# EAGLE design STM32F446_ProtoBoard (EAGLE 9.7.0)
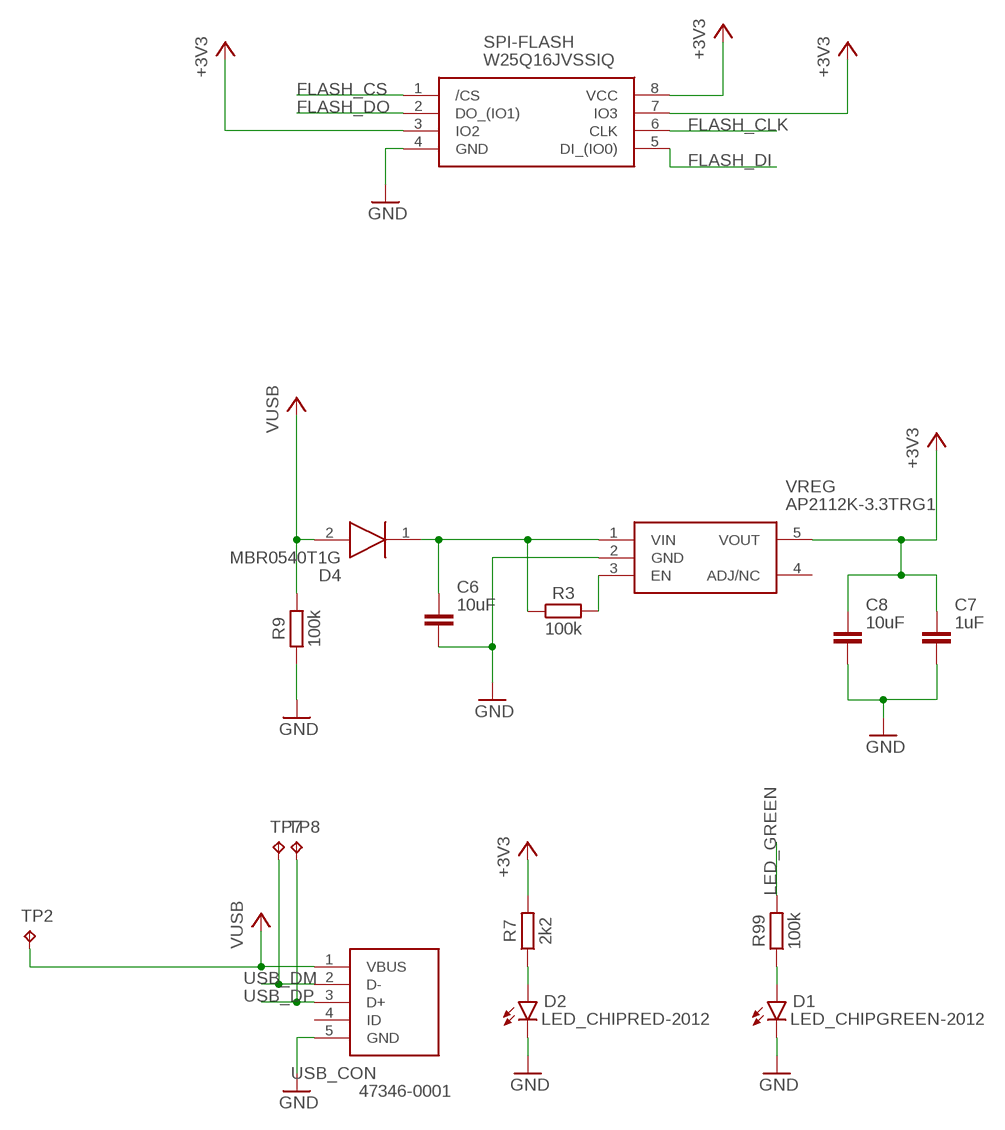
[diagram p0: schematic, sheet 1, part 1 of 2]
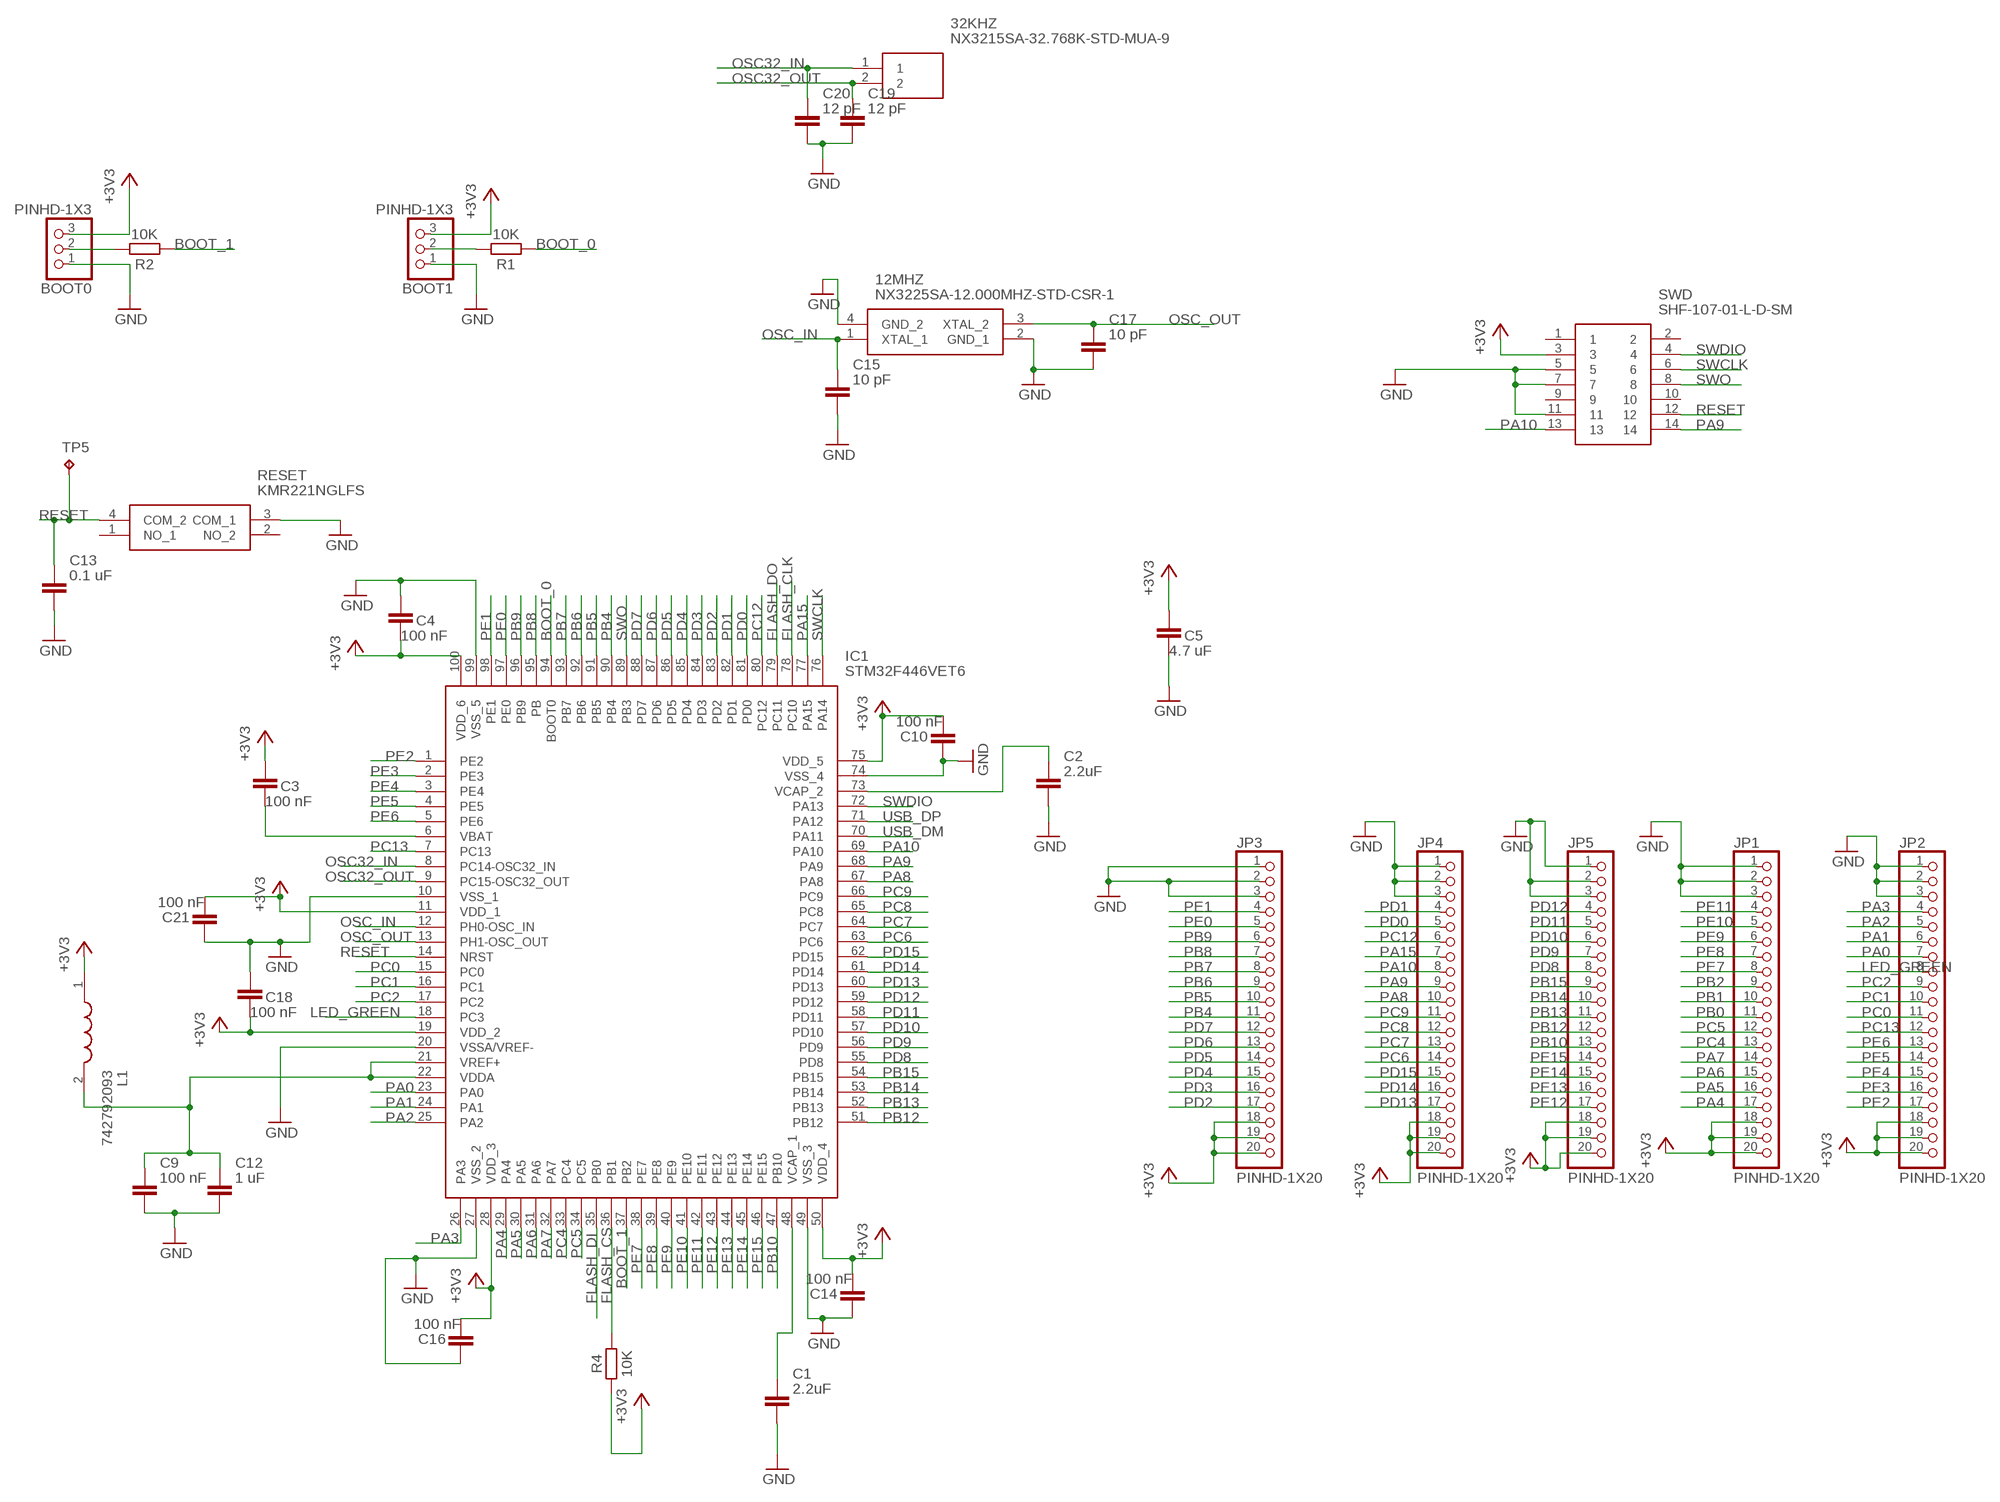
[diagram p1: schematic, sheet 1, part 2 of 2]

## Parts
12MHZ  NX3225SA-12.000MHZ-STD-CSR-1  [NX3225SA12000MHZSTDCSR1]
32KHZ  NX3215SA-32.768K-STD-MUA-9  [NX3215SA]
BOOT0  PINHD-1X3  [1X03]
BOOT1  PINHD-1X3  [1X03]
C1  2.2uF  C_CHIP-0805(2012-METRIC)  [CAPC2012X110]
C2  2.2uF  C_CHIP-0805(2012-METRIC)  [CAPC2012X110]
C3  100 nF  C_CHIP-0805(2012-METRIC)  [CAPC2012X110]
C4  100 nF  C_CHIP-0805(2012-METRIC)  [CAPC2012X110]
C5  4.7 uF  C_CHIP-0805(2012-METRIC)  [CAPC2012X110]
C6  10uF  C_CHIP-0805(2012-METRIC)  [CAPC2012X110]
C7  1uF  C_CHIP-0805(2012-METRIC)  [CAPC2012X110]
C8  10uF  C_CHIP-0805(2012-METRIC)  [CAPC2012X110]
C9  100 nF  C_CHIP-0805(2012-METRIC)  [CAPC2012X110]
C10  100 nF  C_CHIP-0805(2012-METRIC)  [CAPC2012X110]
C12  1 uF  C_CHIP-0805(2012-METRIC)  [CAPC2012X110]
C13  0.1 uF  C_CHIP-0805(2012-METRIC)  [CAPC2012X110]
C14  100 nF  C_CHIP-0805(2012-METRIC)  [CAPC2012X110]
C15  10 pF  C_CHIP-0805(2012-METRIC)  [CAPC2012X110]
C16  100 nF  C_CHIP-0805(2012-METRIC)  [CAPC2012X110]
C17  10 pF  C_CHIP-0805(2012-METRIC)  [CAPC2012X110]
C18  100 nF  C_CHIP-0805(2012-METRIC)  [CAPC2012X110]
C19  12 pF  C_CHIP-0805(2012-METRIC)  [CAPC2012X110]
C20  12 pF  C_CHIP-0805(2012-METRIC)  [CAPC2012X110]
C21  100 nF  C_CHIP-0805(2012-METRIC)  [CAPC2012X110]
D1  LED_CHIPGREEN-2012  [LEDC2012X110N_G]
D2  LED_CHIPRED-2012  [LEDC2012X110N_R]
D4  MBR0540T1G  [SOD3716X135N]
IC1  STM32F446VET6  [QFP50P1600X1600X160-100N]
JP1  PINHD-1X20  [1X20]
JP2  PINHD-1X20  [1X20]
JP3  PINHD-1X20  [1X20]
JP4  PINHD-1X20  [1X20]
JP5  PINHD-1X20  [1X20]
L1  742792093  [CAPC2012X110N]
R1  10K  R_CHIP-0805(2012-METRIC)  [RESC2012X65]
R2  10K  R_CHIP-0805(2012-METRIC)  [RESC2012X65]
R3  100k  R_CHIP-0805(2012-METRIC)  [RESC2012X65]
R4  10K  R_CHIP-0805(2012-METRIC)  [RESC2012X65]
R7  2k2  R_CHIP-0805(2012-METRIC)  [RESC2012X65]
R9  100k  R_CHIP-0805(2012-METRIC)  [RESC2012X65]
R99  100k  R_CHIP-0805(2012-METRIC)  [RESC2012X65]
RESET  KMR221NGLFS  [KMR221NGLFS]
SPI-FLASH  W25Q16JVSSIQ  [SOIC127P790X216-8N]
SWD  SHF-107-01-L-D-SM  [SHF-107-01-X-D-SM]
TP2  TPTP20R  [TP20R]
TP5  TPTP20R  [TP20R]
TP7  TPTP20R  [TP20R]
TP8  TPTP20R  [TP20R]
USB_CON  47346-0001  [47346-0001]
VREG  AP2112K-3.3TRG1  [SOT95P282X130-5N]

## Nets
+3V3: BOOT0.3 BOOT1.3 C3.1 C4.2 C5.1 C7.1 C8.1 C10.2 C14.2 C16.2 C18.2 C21.2 IC1.11(VDD_1) IC1.19(VDD_2) IC1.28(VDD_3) IC1.50(VDD_4) IC1.75(VDD_5) IC1.100(VDD_6) JP1.18 JP1.19 JP1.20 JP2.18 JP2.19 JP2.20 JP3.18 JP3.19 JP3.20 JP4.18 JP4.19 JP4.20 JP5.18 JP5.19 JP5.20 L1.1 R4.1 R7.2 SPI-FLASH.3(IO2) SPI-FLASH.7(IO3) SPI-FLASH.8(VCC) SWD.3 VREG.5(VOUT)
+5V: D4.2(A) R9.2 TP2.TP USB_CON.1(VBUS) ; supply symbol labelled VUSB
BOOT_0: IC1.94(BOOT0) R1.1
BOOT_1: IC1.37(PB2) R2.1
FLASH_CLK: IC1.78(PC10) SPI-FLASH.6(CLK)
FLASH_CS: IC1.36(PB1) R4.2 SPI-FLASH.1(/CS)
FLASH_DI: IC1.35(PB0) SPI-FLASH.5(DI_(IO0))
FLASH_DO: IC1.79(PC11) SPI-FLASH.2(DO_(IO1))
GND: 12MHZ.2(GND_1) 12MHZ.4(GND_2) BOOT0.1 BOOT1.1 C1.2 C2.2 C4.1 C5.2 C6.2 C7.2 C8.2 C9.2 C10.1 C12.2 C13.2 C14.1 C15.2 C16.1 C17.2 C18.1 C19.2 C20.2 C21.1 D1.1(C) D2.1(C) IC1.10(VSS_1) IC1.20(VSSA/VREF-) IC1.27(VSS_2) IC1.49(VSS_3) IC1.74(VSS_4) IC1.99(VSS_5) JP1.1 JP1.2 JP1.3 JP2.1 JP2.2 JP2.3 JP3.1 JP3.2 JP3.3 JP4.1 JP4.2 JP4.3 JP5.1 JP5.2 JP5.3 R9.1 RESET.3(COM_1) SPI-FLASH.4(GND) SWD.5 SWD.7 SWD.11 USB_CON.5(GND) VREG.2(GND)
LED_GREEN: IC1.18(PC3) JP2.8 R99.2
N$1: C6.1 D4.1(K) R3.1 VREG.1(VIN)
N$2: R3.2 VREG.3(EN)
N$3: D2.2(A) R7.1
N$4: D1.2(A) R99.1
N$5: C1.1 IC1.48(VCAP_1)
N$6: C3.2 IC1.6(VBAT)
N$7: BOOT1.2 R1.2
N$8: C2.1 IC1.73(VCAP_2)
N$9: BOOT0.2 R2.2
N$10: C9.1 C12.1 IC1.21(VREF+) IC1.22(VDDA) L1.2
OSC32_IN: 32KHZ.1 C20.1 IC1.8(PC14-OSC32_IN)
OSC32_OUT: 32KHZ.2 C19.1 IC1.9(PC15-OSC32_OUT)
OSC_IN: 12MHZ.1(XTAL_1) C15.1 IC1.12(PH0-OSC_IN)
OSC_OUT: 12MHZ.3(XTAL_2) C17.1 IC1.13(PH1-OSC_OUT)
PA0: IC1.23(PA0) JP2.7
PA1: IC1.24(PA1) JP2.6
PA2: IC1.25(PA2) JP2.5
PA3: IC1.26(PA3) JP2.4
PA4: IC1.29(PA4) JP1.17
PA5: IC1.30(PA5) JP1.16
PA6: IC1.31(PA6) JP1.15
PA7: IC1.32(PA7) JP1.14
PA8: IC1.67(PA8) JP4.10
PA9: IC1.68(PA9) JP4.9 SWD.14
PA10: IC1.69(PA10) JP4.8 SWD.13
PA15: IC1.77(PA15) JP4.7
PB0: JP1.11
PB1: JP1.10
PB2: JP1.9
PB4: IC1.90(PB4) JP3.11
PB5: IC1.91(PB5) JP3.10
PB6: IC1.92(PB6) JP3.9
PB7: IC1.93(PB7) JP3.8
PB8: IC1.95(PB) JP3.7
PB9: IC1.96(PB9) JP3.6
PB10: IC1.47(PB10) JP5.13
PB12: IC1.51(PB12) JP5.12
PB13: IC1.52(PB13) JP5.11
PB14: IC1.53(PB14) JP5.10
PB15: IC1.54(PB15) JP5.9
PC0: IC1.15(PC0) JP2.11
PC1: IC1.16(PC1) JP2.10
PC2: IC1.17(PC2) JP2.9
PC4: IC1.33(PC4) JP1.13
PC5: IC1.34(PC5) JP1.12
PC6: IC1.63(PC6) JP4.14
PC7: IC1.64(PC7) JP4.13
PC8: IC1.65(PC8) JP4.12
PC9: IC1.66(PC9) JP4.11
PC12: IC1.80(PC12) JP4.6
PC13: IC1.7(PC13) JP2.12
PD0: IC1.81(PD0) JP4.5
PD1: IC1.82(PD1) JP4.4
PD2: IC1.83(PD2) JP3.17
PD3: IC1.84(PD3) JP3.16
PD4: IC1.85(PD4) JP3.15
PD5: IC1.86(PD5) JP3.14
PD6: IC1.87(PD6) JP3.13
PD7: IC1.88(PD7) JP3.12
PD8: IC1.55(PD8) JP5.8
PD9: IC1.56(PD9) JP5.7
PD10: IC1.57(PD10) JP5.6
PD11: IC1.58(PD11) JP5.5
PD12: IC1.59(PD12) JP5.4
PD13: IC1.60(PD13) JP4.17
PD14: IC1.61(PD14) JP4.16
PD15: IC1.62(PD15) JP4.15
PE0: IC1.97(PE0) JP3.5
PE1: IC1.98(PE1) JP3.4
PE2: IC1.1(PE2) JP2.17
PE3: IC1.2(PE3) JP2.16
PE4: IC1.3(PE4) JP2.15
PE5: IC1.4(PE5) JP2.14
PE6: IC1.5(PE6) JP2.13
PE7: IC1.38(PE7) JP1.8
PE8: IC1.39(PE8) JP1.7
PE9: IC1.40(PE9) JP1.6
PE10: IC1.41(PE10) JP1.5
PE11: IC1.42(PE11) JP1.4
PE12: IC1.43(PE12) JP5.17
PE13: IC1.44(PE13) JP5.16
PE14: IC1.45(PE14) JP5.15
PE15: IC1.46(PE15) JP5.14
RESET: C13.1 IC1.14(NRST) RESET.4(COM_2) SWD.12 TP5.TP
SWCLK: IC1.76(PA14) SWD.6
SWDIO: IC1.72(PA13) SWD.4
SWO: IC1.89(PB3) SWD.8
USB_DM: IC1.70(PA11) TP7.TP USB_CON.2(D-)
USB_DP: IC1.71(PA12) TP8.TP USB_CON.3(D+)
Unconnected: RESET.1(NO_1) RESET.2(NO_2) SWD.1 SWD.2 SWD.9 SWD.10 USB_CON.4(ID) VREG.4(ADJ/NC)

## Library data of the parts
12MHZ = SamacSys_Parts:NX3225SA-12.000MHZ-STD-CSR-1: Crystals CRYSTAL 12MHZ 8PF SMD Source: Datasheet <https://media.digikey.com/pdf/Data Sheets/NDK PDFs/NX3225SA.pdf>; DESCRIPTION: Crystals CRYSTAL 12MHZ 8PF SMD; HEIGHT: 0.6mm; MANUFACTURER_NAME: NDK; MANUFACTURER_PART_NUMBER: NX3225SA-12.000MHZ-STD-CSR-1; MOUSER_PART_NUMBER: 344-NX3225SA12MCSR1; MOUSER_PRICE-STOCK: https://www.mouser.co.uk/ProductDetail/NDK/NX3225SA-12000MHZ-STD-CSR-1?qs=55YtniHzbhAnr2FgHSa1nw%3D%3D
32KHZ = SamacSys_Parts:NX3215SA-32.768K-STD-MUA-9: 32.768kHz +/-20ppm Crystal 9pF 70 kOhms 2-SMD, No Lead Source: Datasheet <http://www.ndk.com/images/products/catalog/c_NX3215SA-STD-MUA-14_e.pdf>; DESCRIPTION: 32.768kHz +/-20ppm Crystal 9pF 70 kOhms 2-SMD, No Lead; HEIGHT: mm; MANUFACTURER_NAME: NDK; MANUFACTURER_PART_NUMBER: NX3215SA-32.768K-STD-MUA-9; MOUSER_PART_NUMBER: 344-NX3215SA32768K9; MOUSER_PRICE-STOCK: https://www.mouser.co.uk/ProductDetail/NDK/NX3215SA-32768K-STD-MUA-9?qs=55YtniHzbhBxaiDkis6GSg%3D%3D
BOOT0 BOOT1 = Connector:PINHD-1X3: PIN HEADER; CATEGORY: CONNECTOR; SUB-CATEGORY: PIN-HEADER
C1-C10 C12-C21 = Capacitor:C: Capacitor - Generic; CATEGORY: Capacitor
D1 = Opto-Electronic:LED_CHIP: LED - Generic; CATEGORY: Opto-Electronic; COLOR: Green; SUB-CATEGORY: LED
D2 = Opto-Electronic:LED_CHIP: LED - Generic; CATEGORY: Opto-Electronic; COLOR: Red; SUB-CATEGORY: LED
D4 = SamacSys_Parts:MBR0540T1G: 0.5A 40V Schottky Rectifier, MBR0540T1G ON Semiconductor MBR0540T1G Schottky Diode, 0.5A, 40V, 2-Pin SOD-123 Source: Datasheet <http://www.onsemi.com/pub/Collateral/MBR0540T1-D.PDF>; DESCRIPTION: 0.5A 40V Schottky Rectifier, MBR0540T1G ON Semiconductor MBR0540T1G Schottky Diode, 0.5A, 40V, 2-Pin SOD-123; HEIGHT: 1.35mm; MANUFACTURER_NAME: ON Semiconductor; MANUFACTURER_PART_NUMBER: MBR0540T1G; MOUSER_PART_NUMBER: 863-MBR0540T1G; MOUSER_PRICE-STOCK: https://www.mouser.co.uk/ProductDetail/ON-Semiconductor/MBR0540T1G?qs=3JMERSakebqeY0cO5%252BUPCQ%3D%3D
IC1 = SamacSys_Parts:STM32F446VET6: STMICROELECTRONICS - STM32F446VET6 - MCU, 32BIT, CORTEX-M4, 180MHZ, LQFP-100 Source: Datasheet; DESCRIPTION: STMICROELECTRONICS - STM32F446VET6 - MCU, 32BIT, CORTEX-M4, 180MHZ, LQFP-100; HEIGHT: 1.6mm; MANUFACTURER_NAME: STMicroelectronics; MANUFACTURER_PART_NUMBER: STM32F446VET6; MOUSER_PART_NUMBER: 511-STM32F446VET6; MOUSER_PRICE-STOCK: https://www.mouser.co.uk/ProductDetail/STMicroelectronics/STM32F446VET6?qs=Ok1pvOkw6%2Fq9jAtbG%252BoMSQ%3D%3D
JP1-JP5 = Connector:PINHD-1X20: PIN HEADER; CATEGORY: CONNECTOR; SUB-CATEGORY: PIN-HEADER
L1 = SamacSys_Parts:742792093: Wurth WE-CBF Series +/-25% Ferrite Multilayer SMD Inductor, 0805 (2012M) Case, 200mA dc 600m Rdc Source: Datasheet; DESCRIPTION: Wurth WE-CBF Series +/-25% Ferrite Multilayer SMD Inductor, 0805 (2012M) Case, 200mA dc 600m Rdc; HEIGHT: 1.1mm; MANUFACTURER_NAME: Wurth Elektronik; MANUFACTURER_PART_NUMBER: 742792093; MOUSER_PART_NUMBER: 710-742792093; MOUSER_PRICE-STOCK: https://www.mouser.co.uk/ProductDetail/Wurth-Elektronik/742792093?qs=5twSNpOB8IAc9a1vXvOuYw%3D%3D
R1-R4 R7 R9 R99 = Resistor:R: Resistor Fixed - Generic; CATEGORY: Resistor; SUB-CATEGORY: Fixed
RESET = SamacSys_Parts:KMR221NGLFS: KMR221NGLFS (Tactile Switches) Source: Datasheet <https://www.ckswitches.com/media/1479/kmr2.pdf>; DESCRIPTION: KMR221NGLFS (Tactile Switches); HEIGHT: 1.9mm; MANUFACTURER_NAME: C & K COMPONENTS; MANUFACTURER_PART_NUMBER: KMR221NGLFS; MOUSER_PART_NUMBER: 611-KMR221NGLFS; MOUSER_PRICE-STOCK: https://www.mouser.co.uk/ProductDetail/CK/KMR221NGLFS?qs=sb%252But3Lm4x2H4qewmcuXNA%3D%3D
SPI-FLASH = SamacSys_Parts:W25Q16JVSSIQ: NOR Flash Serial-SPI 3V/3.3V 16M-bit 6ns 8-Pin SOIC Tube Source: Datasheet <https://www.winbond.com/resource-files/w25q16jv spi revd 08122016.pdf>; DESCRIPTION: NOR Flash Serial-SPI 3V/3.3V 16M-bit 6ns 8-Pin SOIC Tube; HEIGHT: 2.16mm; MANUFACTURER_NAME: Winbond; MANUFACTURER_PART_NUMBER: W25Q16JVSSIQ; MOUSER_PART_NUMBER: 454-W25Q16JVSSIQ; MOUSER_PRICE-STOCK: https://www.mouser.co.uk/ProductDetail/Winbond/W25Q16JVSSIQ?qs=qSfuJ%252Bfl%2Fd46L%2F1QrQC%2Fog%3D%3D
SWD = SamacSys_Parts:SHF-107-01-L-D-SM: 14 Position, Dual - Row, Shrouded Terminal Strip, 0.050" pitch Source: Datasheet <https://componentsearchengine.com/Datasheets/1/SHF-107-01-L-D-SM.pdf>; DESCRIPTION: 14 Position, Dual - Row, Shrouded Terminal Strip, 0.050&quot; pitch; HEIGHT: 5mm; MANUFACTURER_NAME: SAMTEC; MANUFACTURER_PART_NUMBER: SHF-107-01-L-D-SM; MOUSER_PART_NUMBER: 200-SHF10701LDSM; MOUSER_PRICE-STOCK: https://www.mouser.com/Search/Refine.aspx?Keyword=200-SHF10701LDSM
TP2 TP5 TP7 TP8 = testpad:TP: Test pad
USB_CON = SamacSys_Parts:47346-0001: Micro USB B Receptacle Bottom Mount Assy Molex Right Angle SMT Type B Version 2.0 Micro USB Connector Socket, 30 V ac, 1A 47352 MICRO-USB Source: Datasheet <http://www.molex.com/pdm_docs/sd/473460001_sd.pdf>; DESCRIPTION: Micro USB B Receptacle Bottom Mount Assy Molex Right Angle SMT Type B Version 2.0 Micro USB Connector Socket, 30 V ac, 1A 47352 MICRO-USB; HEIGHT: mm; MANUFACTURER_NAME: Molex; MANUFACTURER_PART_NUMBER: 47346-0001; MOUSER_PART_NUMBER: 538-47346-0001; MOUSER_PRICE-STOCK: https://www.mouser.co.uk/ProductDetail/Molex/47346-0001?qs=c2CV6XM0DweJBWaSeyWeCw%3D%3D
VREG = SamacSys_Parts:AP2112K-3.3TRG1: 600mA 3.3V LDO Regulator Enable SOT23-5 DiodesZetex AP2112K-3.3TRG1, LDO Voltage Regulator, 3.3 V +/-1.5%, 2.5 6 Vin, 5-Pin SOT-23 Source: Datasheet; DESCRIPTION: 600mA 3.3V LDO Regulator Enable SOT23-5 DiodesZetex AP2112K-3.3TRG1, LDO Voltage Regulator, 3.3 V +/-1.5%, 2.5 6 Vin, 5-Pin SOT-23; HEIGHT: 1.3mm; MANUFACTURER_NAME: Diodes Inc.; MANUFACTURER_PART_NUMBER: AP2112K-3.3TRG1; MOUSER_PART_NUMBER: 621-AP2112K-3.3TRG1; MOUSER_PRICE-STOCK: https://www.mouser.co.uk/ProductDetail/Diodes-Incorporated/AP2112K-33TRG1?qs=x6A8l6qLYDDPYHosCdzh%2FA%3D%3D

## Board
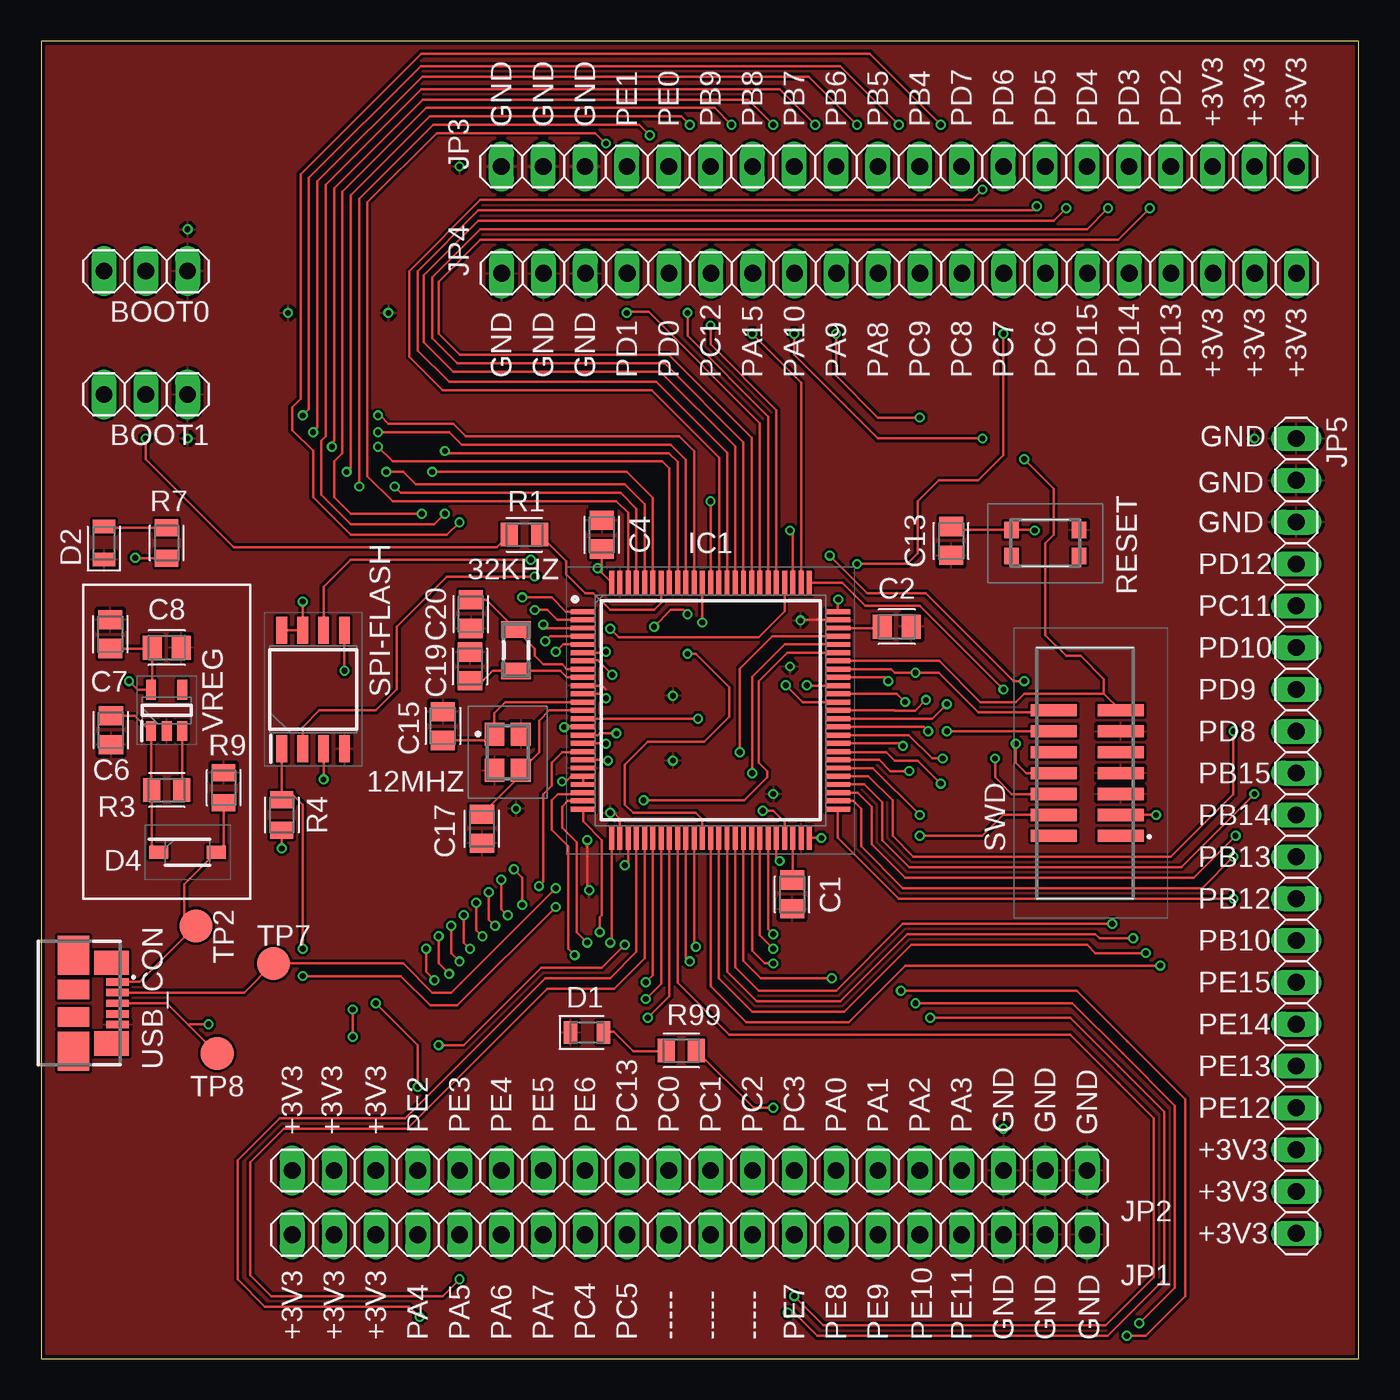
[diagram p2: board, top side]
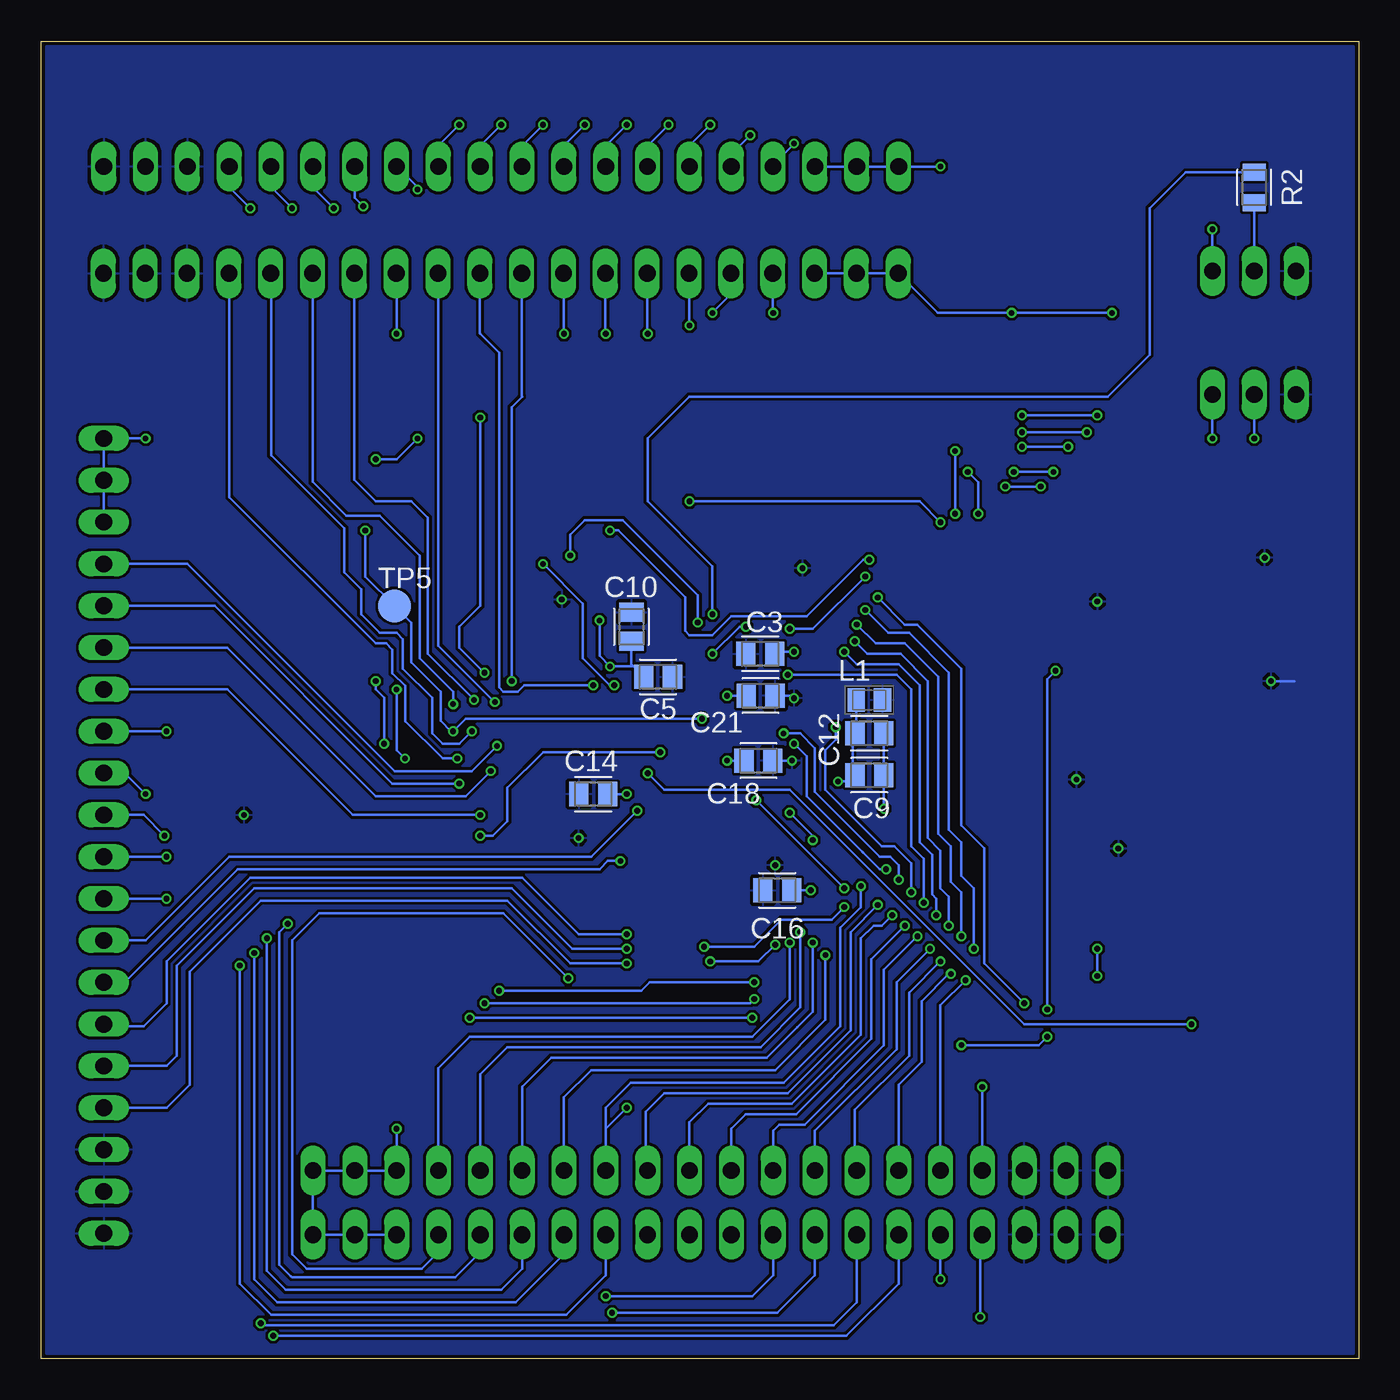
[diagram p3: board, bottom side, seen from below]

Size 80 x 80 mm. Coordinates in mm from the lower left corner, seen from the top.
Outline: 0,0 80,0 80,80 0,80 0,0
Copper layers (1*16): Top 0.018mm / dielectric 1.55mm / Bottom 0.018mm
Design rules "eC_2Layer_PClass6_BaseCopperO18_eCDefault": minimum track width 0.15mm, minimum drill 0.35mm, track to track 0.15mm, track to pad 0.15mm, pad to pad 0.15mm, via to via 0.15mm, smd to smd 0mil, copper to edge 0.25mm, drill to drill 0.35mm, minimum pad ring 0.175mm, minimum via ring 0.125mm, stop-mask expansion 0mil, vias tented up to drill 0.45mm, thermal gap 0.2mm

### Footprints (pad centres in the part's own frame; a part is rotated, then mirrored left to right if it is on the bottom)
NX3225SA12000MHZSTDCSR1 = smd 1.4 x 1.2: 1 -1.1,-0.8; 2 1.1,-0.8; 3 1.1,0.8; 4 -1.1,0.8
NX3215SA = smd 1 x 1.8: 1 -1.25,0; 2 1.25,0
1X03 = drill 1.016 long: 1 -2.54,0; 2 0,0; 3 2.54,0
CAPC2012X110 = smd 1.165 x 1.465: 1 -0.875,0; 2 0.875,0
LEDC2012X110N_G = smd 0.817 x 1.352: 1 -1,0 | smd 0.822 x 1.352: 2 0.998,0
LEDC2012X110N_R = smd 0.817 x 1.352: 1 -1,0 | smd 0.822 x 1.352: 2 0.998,0
SOD3716X135N = smd 1.15 x 0.8: 1 -1.75,0; 2 1.75,0
QFP50P1600X1600X160-100N = smd 1.475 x 0.3: 1 -7.738,6; 2 -7.738,5.5; 3 -7.738,5; 4 -7.738,4.5; 5 -7.738,4; 6 -7.738,3.5; 7 -7.738,3; 8 -7.738,2.5; 9 -7.738,2; 10 -7.738,1.5; 11 -7.738,1; 12 -7.738,0.5; 13 -7.738,0; 14 -7.738,-0.5; 15 -7.738,-1; 16 -7.738,-1.5; 17 -7.738,-2; 18 -7.738,-2.5; 19 -7.738,-3; 20 -7.738,-3.5; 21 -7.738,-4; 22 -7.738,-4.5; 23 -7.738,-5; 24 -7.738,-5.5; 25 -7.738,-6; 51 7.738,-6; 52 7.738,-5.5; 53 7.738,-5; 54 7.738,-4.5; 55 7.738,-4; 56 7.738,-3.5; 57 7.738,-3; 58 7.738,-2.5; 59 7.738,-2; 60 7.738,-1.5; 61 7.738,-1; 62 7.738,-0.5; 63 7.738,0; 64 7.738,0.5; 65 7.738,1; 66 7.738,1.5; 67 7.738,2; 68 7.738,2.5; 69 7.738,3; 70 7.738,3.5; 71 7.738,4; 72 7.738,4.5; 73 7.738,5; 74 7.738,5.5; 75 7.738,6 | smd 0.3 x 1.475: 26 -6,-7.738; 27 -5.5,-7.738; 28 -5,-7.738; 29 -4.5,-7.738; 30 -4,-7.738; 31 -3.5,-7.738; 32 -3,-7.738; 33 -2.5,-7.738; 34 -2,-7.738; 35 -1.5,-7.738; 36 -1,-7.738; 37 -0.5,-7.738; 38 0,-7.738; 39 0.5,-7.738; 40 1,-7.738; 41 1.5,-7.738; 42 2,-7.738; 43 2.5,-7.738; 44 3,-7.738; 45 3.5,-7.738; 46 4,-7.738; 47 4.5,-7.738; 48 5,-7.738; 49 5.5,-7.738; 50 6,-7.738; 76 6,7.738; 77 5.5,7.738; 78 5,7.738; 79 4.5,7.738; 80 4,7.738; 81 3.5,7.738; 82 3,7.738; 83 2.5,7.738; 84 2,7.738; 85 1.5,7.738; 86 1,7.738; 87 0.5,7.738; 88 0,7.738; 89 -0.5,7.738; 90 -1,7.738; 91 -1.5,7.738; 92 -2,7.738; 93 -2.5,7.738; 94 -3,7.738; 95 -3.5,7.738; 96 -4,7.738; 97 -4.5,7.738; 98 -5,7.738; 99 -5.5,7.738; 100 -6,7.738
1X20 = drill 1.016 long: 1 -24.13,0; 2 -21.59,0; 3 -19.05,0; 4 -16.51,0; 5 -13.97,0; 6 -11.43,0; 7 -8.89,0; 8 -6.35,0; 9 -3.81,0; 10 -1.27,0; 11 1.27,0; 12 3.81,0; 13 6.35,0; 14 8.89,0; 15 11.43,0; 16 13.97,0; 17 16.51,0; 18 19.05,0; 19 21.59,0; 20 24.13,0
CAPC2012X110N = smd 1.05 x 1.42: 1 -0.79,0; 2 0.79,0
RESC2012X65 = smd 1.031 x 1.42: 1 -0.919,0; 2 0.919,0
KMR221NGLFS = smd 0.9 x 1: 1 -2.05,-0.8; 2 2.05,-0.8; 3 2.05,0.8; 4 -2.05,0.8
SOIC127P790X216-8N = smd 1.65 x 0.65: 1 -3.6,1.905; 2 -3.6,0.635; 3 -3.6,-0.635; 4 -3.6,-1.905; 5 3.6,-1.905; 6 3.6,-0.635; 7 3.6,0.635; 8 3.6,1.905
SHF-107-01-X-D-SM = smd 0.74 x 2.795: 1 -3.81,-2.033; 2 -3.81,2.033; 3 -2.54,-2.033; 4 -2.54,2.033; 5 -1.27,-2.033; 6 -1.27,2.033; 7 0,-2.033; 8 0,2.033; 9 1.27,-2.033; 10 1.27,2.033; 11 2.54,-2.033; 12 2.54,2.033; 13 3.81,-2.033; 14 3.81,2.033
TP20R = smd 2 x 2: TP 0,0
47346-0001 = smd 0.45 x 1.38: 1 1.3,-4.81; 2 0.65,-4.81; 3 0,-4.81; 4 -0.65,-4.81; 5 -1.3,-4.81 | smd 1.475 x 2.1: 6 -2.453,-4.45; 7 2.453,-4.45 | smd 1.175 x 1.9: 8 0.838,-2.15; 9 -0.838,-2.15 | smd 2.375 x 1.9: 10 2.913,-2.15; 11 -2.913,-2.15
SOT95P282X130-5N = smd 1.2 x 0.6: 1 -1.25,0.95; 2 -1.25,0; 3 -1.25,-0.95; 4 1.25,-0.95; 5 1.25,0.95

### Placement (x,y rotation side)
12MHZ  28.32,36.83 270 top
32KHZ  28.83,43.02 270 top
BOOT0  6.35,66.04 180 top
BOOT1  6.35,58.55 180 top
C1  45.59,28.19 270 top
C2  51.94,44.45 0 top
C3  36.34,42.8 0 bottom
C4  34.04,50.04 270 top
C5  42.55,41.4 180 bottom
C6  4.24,38.16 270 top
C7  4.19,44 90 top
C8  7.62,43.18 0 top
C9  29.72,35.43 0 bottom
C10  44.16,44.45 90 bottom
C12  29.72,37.97 0 bottom
C13  55.24,49.66 270 top
C14  46.48,34.29 180 bottom
C15  24.38,38.42 90 top
C16  35.31,28.45 180 bottom
C17  26.76,32.18 270 top
C18  36.45,36.32 0 bottom
C19  26.04,42.04 90 top
C20  26.09,45.21 270 top
C21  36.32,40.26 0 bottom
D1  33.15,19.81 0 top
D2  3.81,49.53 90 top
D4  8.89,30.76 0 top
IC1  40.64,39.37 0 top
JP1  39.37,7.54 180 top
JP2  39.37,11.43 180 top
JP3  52.07,72.39 0 top
JP4  52.09,65.91 0 top
JP5  76.2,31.75 270 top
L1  29.72,40.01 180 bottom
R1  29.34,50.04 180 top
R2  6.35,71.12 270 bottom
R3  7.62,34.53 0 top
R4  14.61,33.02 90 top
R7  7.62,49.53 270 top
R9  11.08,34.67 270 top
R99  38.86,18.72 0 top
RESET  60.96,49.53 0 top
SPI-FLASH  16.51,40.64 90 top
SWD  63.5,35.56 90 top
TP2  9.4,26.29 270 top
TP5  58.55,45.72 0 bottom
TP7  14.1,24 0 top
TP8  10.69,18.54 0 top
USB_CON  -0.18,21.59 90 top
VREG  7.62,39.37 90 top

### Tracks (layer width: path | path; a pad name or v marks a point on that pad's centre or on a via)
+3V3  (via drill 0.35)
  Top 0.152: C8.1 6.75,40.7 VREG.5 5.86,40.62 v5.33,41.15 | C8.1 6.69,43.12 C7.1 | C8.1 | R7.2 5.75,48.61 v5.71,48.64 | IC1.19 34.37,36.37 v34.42,36.32 | IC1.28 35.64,30.18 v35.43,29.97 | IC1.50 47.36,31.63 v47.37,31.62 | IC1.75 48.38,46.09 v48.39,46.1 | IC1.11 34.03,40.37 v34.29,40.11 | C4.2 34.04,48.26 | 34.04,48.26 v33.78,48.01 | IC1.100 34.04,47.71 34.04,48.26 | SWD.3 v67.69,33.02 | SPI-FLASH.3 v17.14,35.18 | R4.1 v14.61,30.99 | v15.88,45.97 SPI-FLASH.7 SPI-FLASH.8
  Bottom 0.152: v5.33,41.15 3.92,41.15 | C18.2 v34.42,36.32 | v34.29,40.11 34.44,40.26 C21.2
  pour Bottom: 0,0 0,80 80,80 80,0
+5V
  Top 0.152: R9.2 11.08,31.2 D4.2 8.7,28.82 8.7,25.59 | TP2.TP 8.7,25.59 | 8.7,25.59 6,22.89 USB_CON.1
BOOT_0
  Top 0.152: R1.1 31.88,48.42 31.88,47.62 33.02,46.48 33.53,46.48 34.54,45.47 37.21,45.47 37.64,45.9 IC1.94
BOOT_1  (via drill 0.35)
  Top 0.152: IC1.37 40.14,32.76 39.75,33.15 35.94,33.15 35.43,33.66 35.43,36.07 36.83,37.47 40.26,37.47 41.78,38.99 41.78,40.77 39.75,42.8 v39.24,42.8 | v37.21,44.45 38.23,45.47 38.99,45.47 v39.24,45.21
  Bottom 0.152: v39.24,42.8 37.59,44.45 v37.21,44.45 | v39.24,45.21 39.24,48.13 43.18,52.07 43.18,55.88 40.64,58.42 15.24,58.42 12.7,60.96 12.7,69.85 10.51,72.04 R2.1
FLASH_CLK  (via drill 0.35)
  Top 0.152: IC1.78 45.64,50.12 v45.47,50.29 | v29.72,48.51 18.8,48.51 17.14,46.86 SPI-FLASH.6
  Bottom 0.152: v45.47,50.29 44.96,50.29 40.89,46.23 40.89,44.2 40.64,43.94 39.24,43.94 38.1,45.09 33.53,45.09 30.1,48.51 v29.72,48.51
FLASH_CS  (via drill 0.35)
  Top 0.152: IC1.36 39.64,25.13 v39.75,25.02 | v31.24,27.43 25.27,21.46 23.62,21.46 21.84,23.24 v15.88,23.24 | v15.88,24.89 15.88,33.66 15.24,34.29 14.96,34.29 R4.2 SPI-FLASH.1
  Bottom 0.152: v39.75,25.02 36.7,25.02 35.05,26.67 32,26.67 v31.24,27.43 | v15.88,23.24 v15.88,24.89
FLASH_DI  (via drill 0.35)
  Top 0.152: IC1.35 39.14,24.36 v39.37,24.13 | v35.43,25.15 34.04,23.75 30.35,23.75 25.65,19.05 v24.13,19.05 | v18.92,19.56 v18.92,21.21 | v18.41,41.78 SPI-FLASH.5
  Bottom 0.152: v39.37,24.13 36.45,24.13 v35.43,25.15 | v24.13,19.05 19.43,19.05 v18.92,19.56 | v18.92,21.21 18.92,22.86 18.92,22.99 18.92,41.27 v18.41,41.78
FLASH_DO  (via drill 0.35)
  Top 0.152: IC1.79 45.14,45.39 43.56,43.81 35.05,43.81 v34.54,44.32 | v29.97,47.5 24.64,47.5 21.59,44.45 21.59,40.64 20.32,39.37 16.89,39.37 15.88,38.35 SPI-FLASH.2
  Bottom 0.152: v34.54,44.32 33.15,44.32 v29.97,47.5
GND  (via drill 0.35)
  Top 0.152: IC1.10 34.06,40.87 34.29,40.64 | IC1.74 46.14,44.87 v46.1,44.83 | IC1.27 35.14,32.8 34.8,33.15 v34.54,33.15 | v33.15,31.5 33.15,28.57 v33.27,28.45
  Bottom 0.152: C21.1 v38.35,40.26 | C18.1 v38.35,36.32 | C12.2 C9.2 28.84,33.41 v28.83,33.4 | v33.27,28.45 C16.1 | C14.1 v44.45,34.29 | 44.16,43.34 C10.1 44.16,42.14 44.05,42.04 | v14.99,63.5 v21.08,63.5 25.56,63.5 JP4.1 JP4.2 JP4.3 | BOOT0.1 v8.89,68.58 | BOOT1.1 v8.89,55.88 | 44.05,42.04 v45.47,42.04 46.1,42.67 v46.1,44.83 | 44.05,42.04 C5.2 | v34.54,33.15 33.15,31.75 v33.15,31.5 | v58.42,13.97 JP2.3 JP2.2 JP2.1 JP1.1 JP1.2 JP1.3 | v73.66,55.88 JP5.1 JP5.2 JP5.3 | v25.4,72.39 JP3.1 JP3.2 JP3.3
  pour Top: 0,0 0,80 80,80 80,0
LED_GREEN  (via drill 0.35)
  Top 0.152: IC1.18 32.86,36.83 31.62,36.83 30.99,36.2 30.99,34.8 30.48,34.29 30.48,28.96 v30.23,28.7 | R99.2 43.26,15.24 v44.45,15.24
  Bottom 0.152: v30.23,28.7 30.23,27.43 31.5,26.16 31.5,20.19 34.92,16.76 44.2,16.76 45.72,15.24 45.72,13.97 | JP2.8 45.72,13.97 | v44.45,15.24 45.72,13.97
N$1
  Top 0.152: C6.1 5.67,39.04 6.58,38.12 VREG.1 6.67,34.56 R3.1 6.7,31.2 D4.1
N$2
  Top 0.152: VREG.3 8.57,34.56 R3.2
N$3
  Top 0.152: R7.1 3.89,50.45 D2.2
N$4
  Top 0.152: D1.2 34.19,19.86 34.75,19.86 35.94,18.67 37.9,18.67 R99.1
N$5
  Top 0.152: IC1.48 45.64,29.12 C1.1
N$6  (via drill 0.35)
  Top 0.152: IC1.6 34.23,42.87 v34.29,42.93
  Bottom 0.152: v34.29,42.93 35.34,42.93 C3.2
N$7  (via drill 0.35)
  Top 0.152: R1.2 27.66,49.28 11.68,49.28 6.35,54.61 v6.35,55.88
  Bottom 0.152: v6.35,55.88 BOOT1.2
N$8
  Top 0.152: C2.1 50.99,44.37 IC1.73
N$9
  Bottom 0.152: R2.2 BOOT0.2
N$10  (via drill 0.35)
  Top 0.152: IC1.22 IC1.21 32.84,35.43 32.26,35.43 31.88,35.05 v31.62,35.05
  Bottom 0.152: 30.61,35.43 30.73,35.43 30.73,37.83 C12.1 30.51,38.06 L1.2 | 30.61,35.43 C9.1 | v31.62,35.05 30.99,35.05 30.61,35.43
OSC32_IN
  Top 0.152: IC1.8 31.92,41.87 31.62,42.16 30.48,42.16 29.97,42.67 29.97,43.13 32KHZ.1 27.01,46.09 C20.1
OSC32_OUT
  Top 0.152: IC1.9 31.91,41.37 31.51,41.77 32KHZ.2 28.82,41.78 27.43,41.78 26.81,41.16 C19.1
OSC_IN
  Top 0.152: IC1.12 28.19,39.87 27.52,39.2 27.52,37.97 | 12MHZ.1 27.52,37.97 | C15.1 27.09,37.54 27.52,37.97
OSC_OUT
  Top 0.152: IC1.13 30.86,39.37 30.23,38.73 30.23,36.83 12MHZ.3 | 12MHZ.3 | C17.1 29.13,35.42 12MHZ.3
PA0  (via drill 0.35)
  Top 0.152: IC1.23 32.82,34.29 31.37,34.29 30.99,33.91 30.99,32.13 32,31.11 32,24.89 v32.38,24.51
  Bottom 0.152: v32.38,24.51 32.38,20.57 35.43,17.53 46.61,17.53 48.26,15.88 JP2.7
PA1  (via drill 0.35)
  Top 0.152: IC1.24 31.96,33.87 31.62,33.53 31.62,32.26 32.51,31.37 32.51,25.91 v33.15,25.27
  Bottom 0.152: v33.15,25.27 33.15,21.08 34.1,20.13 35.94,18.29 49.02,18.29 50.8,16.51 JP2.6
PA2  (via drill 0.35)
  Top 0.152: IC1.25 32.9,32.63 34.04,31.5 34.04,26.92 33.91,26.8 v33.91,25.91
  Bottom 0.152: v33.91,25.91 33.91,21.34 36.32,18.92 51.69,18.92 53.34,17.27 JP2.5
PA3  (via drill 0.35)
  Top 0.152: IC1.26 34.64,25.37 v34.54,25.27
  Bottom 0.152: v34.54,25.27 34.54,21.84 36.83,19.56 53.98,19.56 55.88,17.65 JP2.4
PA4  (via drill 0.35)
  Top 0.152: v22.99,2.54 22.35,3.17 13.59,3.17 11.94,4.83 11.94,12.06 14.48,14.61 22.1,14.61 30.61,23.11 34.54,23.11 36.14,24.71 IC1.29
  Bottom 0.152: v22.99,2.54 22.99,7.41 JP1.17
PA5  (via drill 0.35)
  Top 0.152: v25.4,4.83 24.38,3.81 13.97,3.81 12.7,5.08 12.7,11.94 14.73,13.97 22.23,13.97 30.73,22.48 34.8,22.48 36.64,24.32 IC1.30
  Bottom 0.152: v25.4,4.83 JP1.16
PA6  (via drill 0.35)
  Top 0.152: v65.91,1.4 67.06,1.4 69.47,3.81 69.47,15.75 65.98,19.24 65.91,19.3 62.87,22.35 v52.2,22.35 | IC1.31 37.14,23.3 v36.7,22.86
  Bottom 0.152: v65.91,1.4 31.11,1.4 27.94,4.57 JP1.15 | v36.7,22.86 43.05,22.86 43.56,22.35 v52.2,22.35
PA7  (via drill 0.35)
  Top 0.152: IC1.32 37.64,22.78 v36.7,21.84 | v66.67,2.16 68.83,4.32 68.83,15.37 65.66,18.54 62.61,21.59 v53.09,21.59
  Bottom 0.152: v66.67,2.16 66.55,2.03 31.88,2.03 30.48,3.43 JP1.14 | v36.7,21.84 36.96,21.59 v53.09,21.59
PA8  (via drill 0.35)
  Top 0.152: IC1.67 51.21,41.37 v51.44,41.15
  Bottom 0.152: v51.44,41.15 51.44,57.78 50.8,58.42 50.82,58.44 50.82,65.14 JP4.10
PA9  (via drill 0.35)
  Top 0.152: IC1.68 51.6,41.87 51.82,41.66 v53.09,41.66 54.48,41.66 56.9,39.24 61.34,39.24 SWD.14 | v53.34,57.15 50.8,57.15 48.26,59.69 v48.26,62.23
  Bottom 0.152: v53.34,57.15 53.34,45.72 54.61,44.45 54.61,43.18 v53.09,41.66 | JP4.9 48.28,65.14 48.28,62.25 v48.26,62.23
PA10  (via drill 0.35)
  Top 0.152: SWD.13 | v59.69,54.61 61.47,52.83 61.47,50.04 60.96,49.53 60.96,43.94 62.23,42.67 63.12,42.67 64.52,41.27 64.52,40.39 | v57.15,55.88 50.8,55.88 45.72,60.96 v45.72,62.23 | 64.52,40.39 SWD.13 | IC1.69 54.53,42.37 57.02,39.88 59.18,39.88 59.69,40.39 64.52,40.39
  Bottom 0.152: v59.69,54.61 58.42,54.61 v57.15,55.88 | JP4.8 45.74,65.14 45.74,62.25 v45.72,62.23
PA15  (via drill 0.35)
  Top 0.152: IC1.77 46.14,59.27 v43.18,62.23
  Bottom 0.152: JP4.7 43.2,65.14 43.2,62.25 v43.18,62.23
PB4  (via drill 0.35)
  Top 0.152: v15.88,57.28 16.26,57.66 16.26,71.7 23.04,78.49 48.26,78.49 48.51,78.49 v52.07,74.93 | v20.45,57.28 20.57,57.28 21.08,56.77 25.02,56.77 25.78,56.01 38.73,56.01 39.64,55.1 IC1.90
  Bottom 0.152: v15.88,57.28 v20.45,57.28 | JP3.11 53.34,73.66 v52.07,74.93
PB5  (via drill 0.35)
  Top 0.152: IC1.91 39.14,54.59 38.23,55.5 25.53,55.5 24.77,56.26 v20.45,56.26 | v16.51,56.26 16.76,56.52 16.76,71.49 23.12,77.85 46.61,77.85 v49.53,74.93
  Bottom 0.152: v20.45,56.26 v16.51,56.26 | JP3.10 50.8,73.66 v49.53,74.93
PB6  (via drill 0.35)
  Top 0.152: v24.51,51.31 23.88,50.67 18.8,50.67 17.02,52.45 17.02,55.75 17.27,56.01 17.27,71.28 23.08,77.09 44.83,77.09 v46.99,74.93 | v24.51,55.12 24.64,55.12 24.77,54.99 38.1,54.99 38.64,54.45 IC1.92
  Bottom 0.152: v24.51,51.31 v24.51,55.12 | JP3.9 48.26,73.66 v46.99,74.93
PB7  (via drill 0.35)
  Top 0.152: IC1.93 38.14,54.06 37.72,54.48 21.34,54.48 v20.45,55.37 | v17.65,55.37 17.65,55.63 17.78,55.75 17.78,71.07 23.16,76.45 42.93,76.45 v44.45,74.93
  Bottom 0.152: v20.45,55.37 v17.65,55.37 | v44.45,74.93 45.72,73.66 JP3.8
PB8  (via drill 0.35)
  Top 0.152: v23.11,51.31 18.8,51.31 17.78,52.32 17.78,54.48 18.29,54.99 18.29,70.86 23.37,75.95 40.89,75.95 v41.91,74.93 | v23.75,53.85 35.56,53.85 37.14,52.27 IC1.95
  Bottom 0.152: v23.11,51.31 23.11,53.21 v23.75,53.85 | v41.91,74.93 43.18,73.66 JP3.7
PB9  (via drill 0.35)
  Top 0.152: IC1.96 36.64,51.88 35.43,53.09 22.73,53.09 21.97,53.85 v20.95,53.85 | v18.54,53.85 18.8,54.1 18.8,70.65 23.58,75.44 38.86,75.44 v39.37,74.93
  Bottom 0.152: v20.95,53.85 v18.54,53.85 | v39.37,74.93 40.64,73.66 JP3.6
PB10  (via drill 0.35)
  Top 0.152: IC1.47 45.14,32.58 44.45,33.27 v43.81,33.27
  Bottom 0.152: v43.81,33.27 46.61,30.48 68.58,30.48 73.66,25.4 JP5.13
PB12  (via drill 0.35)
  Top 0.152: IC1.51 48.38,31.63 52.07,27.94 v72.39,27.94
  Bottom 0.152: JP5.12 v72.39,27.94
PB13  (via drill 0.35)
  Top 0.152: IC1.52 49.31,33.87 49.78,33.4 49.78,31.11 52.32,28.57 70.48,28.57 v72.39,30.48
  Bottom 0.152: v72.39,30.48 JP5.11
PB14  (via drill 0.35)
  Top 0.152: IC1.53 49.58,34.37 50.42,33.53 50.42,31.24 52.45,29.21 69.98,29.21 v72.52,31.75
  Bottom 0.152: v72.52,31.75 73.79,33.02 JP5.10
PB15  (via drill 0.35)
  Top 0.152: IC1.54 49.97,34.87 51.05,33.78 51.05,31.5 52.7,29.84 69.22,29.84 v73.66,34.29
  Bottom 0.152: v73.66,34.29 74.93,35.56 JP5.9
PC0  (via drill 0.35)
  Top 0.152: IC1.15 31.77,38.37 v31.75,38.35 | v27.18,28.32 27.18,26.67 v27.56,26.29
  Bottom 0.152: v31.75,38.35 31.75,37.59 32.38,36.96 32.38,34.54 28.96,31.11 28.19,31.11 27.18,30.1 v27.18,28.32 | v27.56,26.29 29.59,24.26 29.59,19.43 34.16,14.86 37.21,14.86 38.1,13.97 JP2.11
PC1  (via drill 0.35)
  Top 0.152: IC1.16 33.81,37.87 33.91,37.97 v34.92,37.97 | v27.94,29.08 27.94,27.3 v28.32,26.92
  Bottom 0.152: v34.92,37.97 33.91,37.97 33.02,37.08 33.02,34.42 29.08,30.48 28.45,30.48 27.94,29.97 v27.94,29.08 | v28.32,26.92 28.96,26.29 29.46,26.29 30.23,25.53 30.23,19.68 34.42,15.49 39.5,15.49 40.64,14.35 JP2.10
PC2  (via drill 0.35)
  Top 0.152: IC1.17 34.26,37.37 v34.29,37.34 | v28.7,29.72 29.21,29.21 v29.21,27.56
  Bottom 0.152: v34.29,37.34 33.53,36.58 33.53,34.16 30.16,30.8 30.1,30.73 29.08,29.72 v28.7,29.72 | v29.21,27.56 30.86,25.91 30.86,19.94 34.67,16.13 42.16,16.13 43.31,14.99 43.31,11.56 JP2.9
PC4  (via drill 0.35)
  Top 0.152: v45.34,2.79 45.72,2.79 47.12,1.4 64.77,1.4 68.2,4.83 68.2,14.99 65.41,17.78 62.48,20.7 v53.98,20.7 | IC1.33 38.14,22.01 v36.83,20.7
  Bottom 0.152: v45.34,2.79 35.31,2.79 33.02,5.08 JP1.13 | v36.83,20.7 v53.98,20.7
PC5  (via drill 0.35)
  Top 0.152: v45.72,3.81 47.5,2.03 64.64,2.03 67.56,4.95 67.56,14.61 65.47,16.7 65.41,16.76 62.48,19.68 41.78,19.68 38.64,22.83 IC1.34
  Bottom 0.152: v45.72,3.81 36.83,3.81 35.56,5.08 JP1.12
PC6  (via drill 0.35)
  Top 0.152: IC1.63 51.82,39.37 51.83,39.35 53.07,39.35 v53.72,40.01
  Bottom 0.152: v53.72,40.01 56.52,42.8 56.52,51.05 57.53,52.07 59.69,52.07 60.98,53.36 JP4.14
PC7  (via drill 0.35)
  Top 0.152: IC1.64 46.24,39.87 v45.21,40.89 | v49.53,48.26 52.58,48.26 53.21,48.9 53.21,52.07 54.48,53.34 56.9,53.34 58.42,54.86 v58.42,62.23
  Bottom 0.152: v45.21,40.89 45.47,40.89 47.12,42.55 47.12,45.85 v49.53,48.26 | v58.42,62.23 58.42,65.88 JP4.13
PC8  (via drill 0.35)
  Top 0.152: IC1.65 51.96,40.37 v52.45,39.88
  Bottom 0.152: v52.45,39.88 55.88,43.31 55.88,65.88 JP4.12
PC9  (via drill 0.35)
  Top 0.152: IC1.66 46.51,40.87 v46.48,40.89
  Bottom 0.152: v46.48,40.89 50.67,40.89 51.05,40.51 51.94,40.51 52.2,40.77 52.2,61.09 53.34,62.23 53.36,62.25 53.36,65.14 JP4.11
PC12  (via drill 0.35)
  Top 0.152: IC1.80 44.64,57.59 40.64,61.59 v40.64,62.74
  Bottom 0.152: JP4.6 40.66,65.14 40.66,62.76 v40.64,62.74
PC13  (via drill 0.35)
  Top 0.152: IC1.7 33.48,42.37 33.53,42.42 33.78,42.42 v34.67,41.53 | v26.42,27.69 26.42,26.04 v26.8,25.65
  Bottom 0.152: v34.67,41.53 28.07,41.53 27.18,40.64 27.18,31.11 26.42,30.35 v26.42,27.69 | v26.8,25.65 28.83,23.62 28.83,19.05 33.66,14.22 35.18,14.22 35.56,13.84 JP2.12
PD0  (via drill 0.35)
  Top 0.152: IC1.81 44.14,57.21 39.24,62.1 v39.24,63.5
  Bottom 0.152: JP4.5 38.12,64.62 v39.24,63.5
PD1  (via drill 0.35)
  Top 0.152: IC1.82 43.64,56.82 36.89,63.56 35.62,63.56 v35.56,63.5
  Bottom 0.152: JP4.4 35.58,63.52 v35.56,63.5
PD2  (via drill 0.35)
  Top 0.152: IC1.83 43.14,55.92 38.1,60.96 25.4,60.96 24.13,62.23 24.13,65.41 26.67,67.94 65.41,67.94 v67.31,69.85
  Bottom 0.152: JP3.17 68.58,71.12 v67.31,69.85
PD3  (via drill 0.35)
  Top 0.152: IC1.84 42.64,55.66 37.85,60.45 25.27,60.45 23.75,61.98 23.75,65.66 26.67,68.58 63.5,68.58 v64.77,69.85
  Bottom 0.152: JP3.16 66.04,71.12 v64.77,69.85
PD4  (via drill 0.35)
  Top 0.152: IC1.85 42.14,55.4 37.59,59.94 25.02,59.94 23.24,61.72 23.24,65.79 26.54,69.09 60.96,69.09 61.34,69.09 61.47,69.09 v62.23,69.85
  Bottom 0.152: JP3.15 63.5,71.12 v62.23,69.85
PD5  (via drill 0.35)
  Top 0.152: IC1.86 41.64,55.01 37.34,59.31 24.77,59.31 22.86,61.21 22.86,66.04 26.54,69.72 60.2,69.72 v60.45,69.98
  Bottom 0.152: JP3.14 60.96,70.48 v60.45,69.98
PD6  (via drill 0.35)
  Top 0.152: IC1.87 41.17,47.13 41.17,54.72 37.08,58.8 24.38,58.8 22.35,60.83 22.35,66.04 26.67,70.36 56.52,70.36 v57.15,70.99
  Bottom 0.152: JP3.13 57.15,71.12 v57.15,70.99
PD7  (via drill 0.35)
  Top 0.152: v40.64,52.07 IC1.88 | v25.4,50.8 24.64,50.04 18.8,50.04 16.51,52.32 16.51,55.12 15.24,56.39 15.24,57.78 15.75,58.29 15.75,71.91 23.08,79.25 50.29,79.25 v54.61,74.93
  Bottom 0.152: v40.64,52.07 26.67,52.07 v25.4,50.8 | JP3.12 55.88,73.66 v54.61,74.93
PD8  (via drill 0.35)
  Top 0.152: IC1.55 50.23,35.37 51.69,33.91 51.69,31.75 52.96,30.48 68.58,30.48 72.39,34.29 v72.39,38.1
  Bottom 0.152: v72.39,38.1 JP5.8
PD9  (via drill 0.35)
  Top 0.152: IC1.56 50.49,35.87 v53.34,33.02
  Bottom 0.152: v53.34,33.02 61.09,33.02 68.71,40.64 JP5.7
PD10  (via drill 0.35)
  Top 0.152: IC1.57 50.88,36.37 51.56,35.69 v52.7,35.69
  Bottom 0.152: v52.7,35.69 54.23,34.16 59.69,34.16 68.71,43.18 JP5.6
PD11  (via drill 0.35)
  Top 0.152: IC1.58 48.42,36.83 51.31,36.83 51.82,36.32 53.21,36.32 v54.61,34.92
  Bottom 0.152: v54.61,34.92 58.67,34.92 69.47,45.72 JP5.5
PD12  (via drill 0.35)
  Top 0.152: IC1.59 52.16,37.37 v52.32,37.21
  Bottom 0.152: v52.32,37.21 53.85,35.69 58.55,35.69 71.12,48.26 JP5.4
PD13  (via drill 0.35)
  Top 0.152: IC1.60 52.68,37.87 54.1,36.45 v54.74,36.45
  Bottom 0.152: v54.74,36.45 55.63,36.45 57.89,38.72 57.89,40.86 58.67,41.64 58.67,43.05 59.05,43.43 59.69,43.43 68.58,52.32 68.58,52.45 68.58,65.88 JP4.17
PD14  (via drill 0.35)
  Top 0.152: IC1.61 53.58,38.37 v53.85,38.1
  Bottom 0.152: v53.85,38.1 54.61,37.34 55.63,37.34 56.26,37.97 56.26,40.13 58.04,41.91 58.04,43.69 58.42,44.07 59.44,44.07 60.58,45.21 60.58,46.74 61.59,47.75 61.59,50.42 66.04,54.86 66.04,66.04 66.06,66.02 JP4.16
PD15  (via drill 0.35)
  Top 0.152: IC1.62 54.11,38.87 v54.99,39.75
  Bottom 0.152: v54.99,39.75 54.99,40.51 57.02,42.55 57.02,48.77 59.44,51.18 61.47,51.18 63.52,53.24 JP4.15
PE0  (via drill 0.35)
  Top 0.152: v19.3,52.96 19.3,70.44 23.79,74.93 36.32,74.93 v36.96,74.3 | IC1.97 36.14,51.62 35.18,52.58 21.84,52.58 v21.46,52.96
  Bottom 0.152: v19.3,52.96 v21.46,52.96 | v36.96,74.3 38.1,73.15 JP3.5
PE1  (via drill 0.35)
  Top 0.152: IC1.98 35.64,51.35 34.92,52.07 21.34,52.07 19.81,53.59 19.81,70.23 24,74.42 33.66,74.42 v34.29,73.79
  Bottom 0.152: v34.29,73.79 35.56,72.52 JP3.4
PE2  (via drill 0.35)
  Top 0.152: IC1.1 31.85,45.37 30.99,46.23 v29.21,46.23 | v20.32,21.59 22.86,19.05 v22.86,16.51
  Bottom 0.152: v29.21,46.23 27.56,44.58 26.8,44.58 24.13,41.91 24.13,32.38 22.73,30.99 22.73,24 v20.32,21.59 | v22.86,16.51 JP2.17
PE3  (via drill 0.35)
  Top 0.152: IC1.2 31.33,44.87 30.73,45.47 v29.97,45.47 | v23.37,24.89 23.37,23.5 v23.88,22.99
  Bottom 0.152: v29.97,45.47 28.57,44.07 27.3,44.07 24.89,41.66 24.89,32.13 24.13,31.37 24.13,29.34 23.37,28.57 v23.37,24.89 | v23.88,22.99 25.4,21.46 JP2.16
PE4  (via drill 0.35)
  Top 0.152: IC1.3 30.69,44.37 v30.48,44.58 | v24.13,25.65 24.13,24 v24.77,23.37
  Bottom 0.152: v30.48,44.58 29.34,43.43 27.56,43.43 25.53,41.4 25.53,31.88 24.77,31.11 24.77,28.96 24.13,28.32 v24.13,25.65 | v24.77,23.37 24.89,23.37 26.54,21.72 26.54,18.03 27.94,16.64 JP2.15
PE5  (via drill 0.35)
  Top 0.152: IC1.4 30.92,43.87 v30.61,43.56 | v24.89,26.29 24.89,24.64 v25.4,24.13
  Bottom 0.152: v30.61,43.56 29.84,42.8 27.81,42.8 26.16,41.15 26.16,31.62 25.4,30.86 25.4,28.57 24.89,28.07 v24.89,26.29 | v25.4,24.13 27.3,22.23 27.3,18.41 30.61,15.11 30.61,11.56 JP2.14
PE6  (via drill 0.35)
  Top 0.152: IC1.5 31.69,43.37 v31.24,42.93 | v25.65,26.92 25.65,25.27 v26.04,24.89
  Bottom 0.152: v31.24,42.93 30.48,42.16 27.94,42.16 26.67,40.89 26.67,31.37 25.91,30.61 25.91,28.19 25.65,27.94 v25.65,26.92 | v26.04,24.89 28.07,22.86 28.07,18.8 33.02,13.84 JP2.13
PE7  (via drill 0.35)
  Top 0.152: IC1.38 40.64,22.61 42.8,20.45 49.02,20.45 52.45,23.88 v67.94,23.88
  Bottom 0.152: JP1.8 45.72,5.08 48.13,2.67 55.88,2.67 56.01,2.67 66.04,2.67 67.94,4.57 v67.94,23.88
PE8  (via drill 0.35)
  Top 0.152: IC1.39 41.15,23.11 43.18,21.08 48.77,21.08 52.83,25.15 63.5,25.15 64.01,24.64 v67.06,24.64
  Bottom 0.152: JP1.7 48.26,6.35 51.18,3.43 65.66,3.43 67.06,4.83 v67.06,24.64
PE9  (via drill 0.35)
  Top 0.152: IC1.40 41.64,23.51 43.43,21.72 48.51,21.72 52.58,25.78 64.01,25.78 64.26,25.53 v66.29,25.53
  Bottom 0.152: JP1.6 50.8,5.46 52.07,4.19 65.15,4.19 66.29,5.33 v66.29,25.53
PE10  (via drill 0.35)
  Top 0.152: IC1.41 42.14,23.77 43.56,22.35 48.26,22.35 52.32,26.42 v65.02,26.42
  Bottom 0.152: v65.02,26.42 65.53,25.91 65.53,5.71 64.83,5.02 64.77,4.95 54.86,4.95 53.34,6.48 JP1.5
PE11  (via drill 0.35)
  Top 0.152: IC1.42 42.64,24.16 43.69,23.11 v48.01,23.11
  Bottom 0.152: JP1.4 55.88,6.48 56.9,5.46 63.88,5.46 64.77,6.35 64.77,25.4 63.12,27.05 51.94,27.05 v48.01,23.11
PE12  (via drill 0.35)
  Top 0.152: IC1.43 43.18,31.59 43.18,24.77 43.94,24 v44.45,24
  Bottom 0.152: v44.45,24 47.88,24 51.69,27.81 66.67,27.81 70.99,23.5 70.99,16.64 72.39,15.24 JP5.17
PE13  (via drill 0.35)
  Top 0.152: IC1.44 43.64,25.7 v44.45,24.89
  Bottom 0.152: v44.45,24.89 47.75,24.89 51.44,28.57 67.06,28.57 71.75,23.88 71.75,18.41 72.39,17.78 JP5.16
PE14  (via drill 0.35)
  Top 0.152: IC1.45 44.14,26.09 v44.45,25.78
  Bottom 0.152: v44.45,25.78 47.37,25.78 50.8,29.21 67.31,29.21 72.39,24.13 72.39,21.59 73.79,20.19 76.07,20.19 JP5.15
PE15  (via drill 0.35)
  Top 0.152: IC1.46 44.64,30.42 v44.83,30.23
  Bottom 0.152: v44.83,30.23 45.59,30.23 46.1,29.72 68.07,29.72 74.93,22.86 JP5.14
RESET  (via drill 0.35)
  Top 0.152: C13.1 55.45,50.33 RESET.4 60.29,50.33 v60.33,50.29 | IC1.14 v39.87,38.87 v39.88,38.86 | v54.99,38.1 SWD.12
  Bottom 0.152: v39.88,38.86 54.23,38.86 v54.99,38.1 55.12,38.1 55.75,38.73 55.75,40.51 57.53,42.29 57.53,44.7 TP5.TP 60.33,47.5 v60.33,50.29
SWCLK  (via drill 0.35)
  Top 0.152: IC1.76 48.65,47.11 50.04,45.72 53.34,45.72 v58.42,40.64 | v57.91,36.45 57.91,35.31 58.93,34.29 SWD.6
  Bottom 0.152: v58.42,40.64 58.42,36.96 v57.91,36.45
SWDIO  (via drill 0.35)
  Top 0.152: IC1.72 44.38,43.87 42.42,41.91 v42.42,36.83 | v53.34,31.75 57.15,31.75 58.42,33.02 SWD.4
  Bottom 0.152: v42.42,36.83 49.53,36.83 51.69,34.67 51.69,32.64 52.58,31.75 v53.34,31.75
SWO  (via drill 0.35)
  Top 0.152: SWD.8 59.82,35.56 59.18,36.2 v59.18,37.34 | v59.69,41.15 59.05,41.15 53.72,46.48 50.16,46.48 v47.88,48.77 | v40.13,44.7 IC1.89
  Bottom 0.152: v59.18,37.34 59.18,40.13 59.69,40.64 v59.69,41.15 | v47.88,48.77 47.88,50.04 46.99,50.93 44.7,50.93 40.13,46.35 v40.13,44.7
USB_DM  (via drill 0.35)
  Top 0.152: IC1.70 45.28,42.87 43.56,41.15 43.56,36.2 44.07,35.69 44.07,35.31 42.67,33.91 v36.58,33.91 | USB_CON.2 12.33,22.24 TP7.TP 21.97,24 23.75,22.23 24.89,22.23 24.91,22.24 25.46,22.8 v31.24,28.57
  Bottom 0.152: v31.24,28.57 v36.58,33.91
USB_DP  (via drill 0.35)
  Top 0.152: IC1.71 45.15,43.37 43.18,41.4 v43.18,35.56 | USB_CON.3 7.62,21.59 8.95,20.26 | TP8.TP 10.67,18.54 8.95,20.26 | v10.16,20.32 9.02,20.32 8.95,20.26
  Bottom 0.152: v43.18,35.56 42.16,34.54 34.54,34.54 20.32,20.32 v10.16,20.32

### Text on the board
tNames: GND | GND | GND | PE1 | PE0 | PB9 | PB8 | PB7 | PB6 | PB5 | PB4 | PD7 | PD6 | PD5 | PD4 | PD3 | PD2 | +3V3 | +3V3 | +3V3 | GND | GND | GND | PD1 | PD0 | PC12 | PA15 | PA10 | PA9 | PA8 | PC9 | PC8 | PC7 | PC6 | PD15 | PD14 | PD13 | +3V3 | +3V3 | +3V3 | GND | GND | GND | PD12 | PC11 | PD10 | PD9 | PD8 | PB15 | PB14 | PB13 | PB12 | PB10 | PE15 | PE14 | PE13 | PE12 | +3V3 | +3V3 | +3V3 | PE2 | PE3 | PE4 | PE5 | PE6 | PC13 | PC0 | PC1 | PC2 | PC3 | PA0 | PA1 | PA2 | PA3 | GND | GND | GND | +3V3 | +3V3 | +3V3 | +3V3 | +3V3 | +3V3 | PA4 | PA5 | PA6 | PA7 | PC4 | PC5 | ----- | ----- | ----- | PE7 | PE8 | PE9 | PE10 | PE11 | GND | GND | GND